# EasyEDA Pro project cyber_sandglass2.eprj

# Schematic arduino_nano_2
Board Name: arduino_nano_2; Create Date: 2025-11-16; Page Name: P1; Project Name: arduino_nano_2; Schematic Name: arduino_nano_2; Update Date: 2025-11-16; Company: 嘉立创EDA; Page Size: A4; Version: V1.0
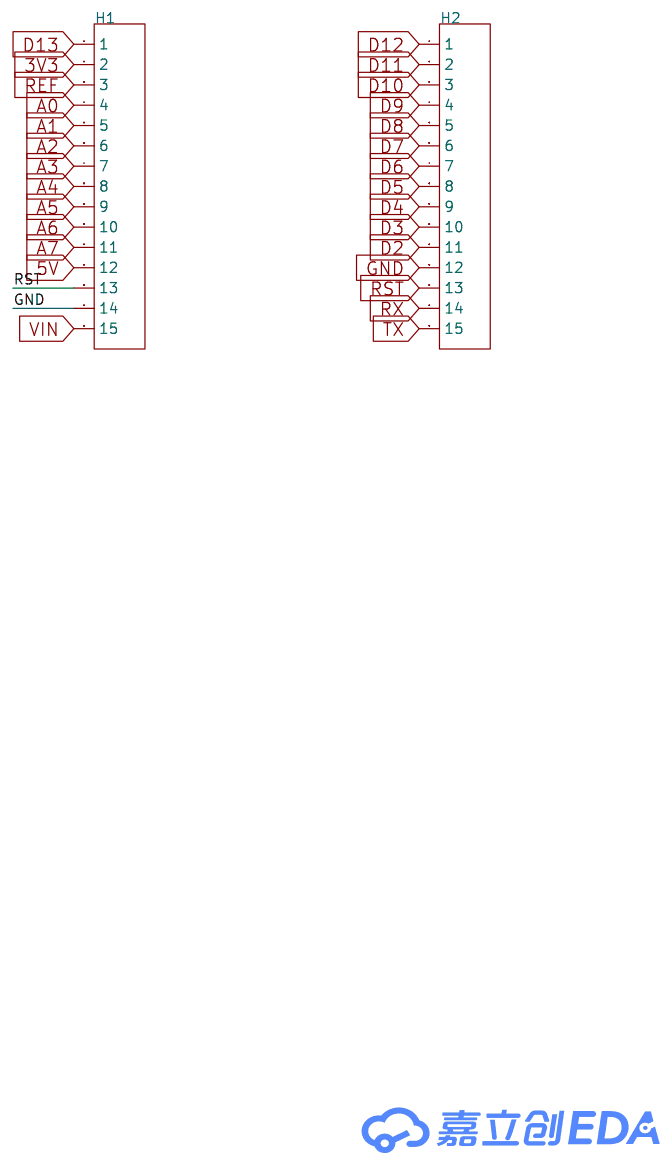
[diagram p0: schematic sheet]

## Parts
H1  -  [HDR-TH_15P-P2.54-V-F-1]
H2  -  [HDR-TH_15P-P2.54-V-F-1]

## Library data of the parts
H1 H2 = HDR-F_2.54_1x15P: Supplier Part: C124408; Supplier Footprint: 插件,

## Nets
3V3: H1.2
5V: H1.12
GND: H1.14 H2.12
VIN: H1.15
A0: H1.4
A1: H1.5
A2: H1.6
A3: H1.7
A4: H1.8
A5: H1.9
A6: H1.10
A7: H1.11
D2: H2.11
D3: H2.10
D4: H2.9
D5: H2.8
D6: H2.7
D7: H2.6
D8: H2.5
D9: H2.4
D10: H2.3
D11: H2.2
D12: H2.1
D13: H1.1
REF: H1.3
RST: H1.13 H2.13
RX: H2.14
TX: H2.15

# Schematic max7219
Board Name: max7219; Create Date: 2025-11-16; Page Name: P1; Project Name: max7219; Schematic Name: max7219; Update Date: 2025-11-16; Company: 嘉立创EDA; Page Size: A4; Version: V1.0
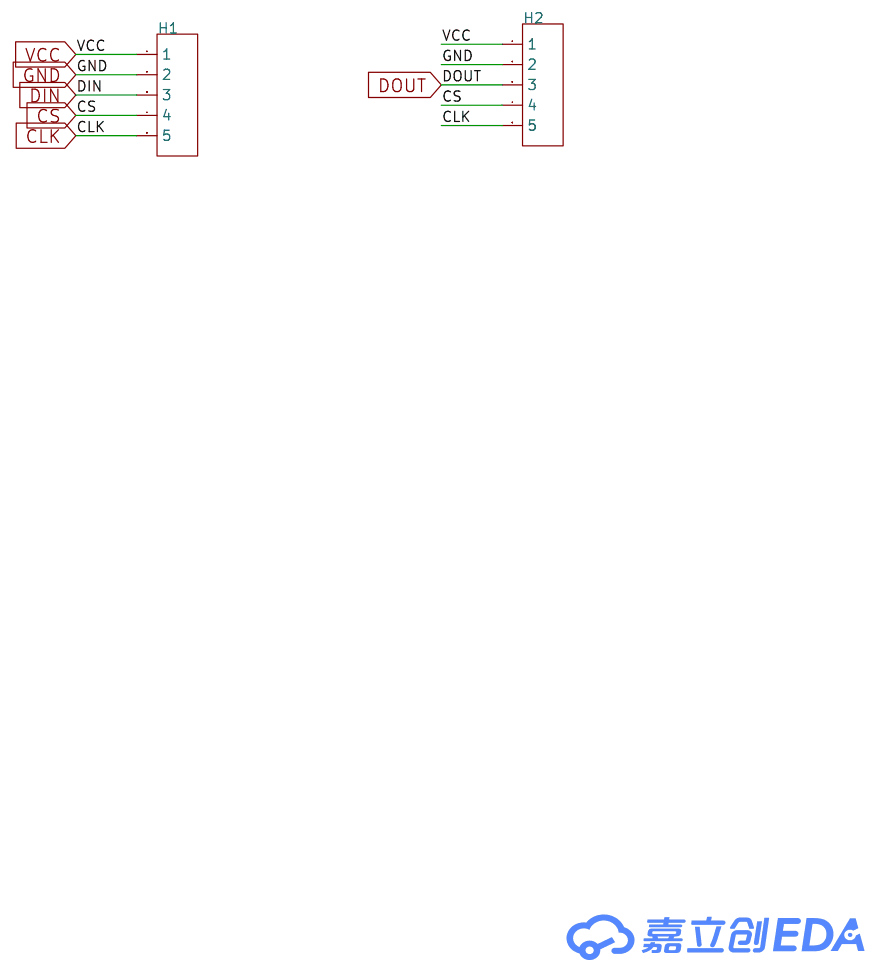
[diagram p1: schematic sheet]

## Parts
H1  -  [HDR-TH_5P-P2.54-V-F]
H2  -  [HDR-TH_5P-P2.54-V-F]

## Library data of the parts
H1 H2 = HDR-F_2.54_1x5P: Supplier Part: C50950; Supplier Footprint: 插件

## Nets
GND: H1.2 H2.2
VCC: H1.1 H2.1
CLK: H1.5 H2.5
CS: H1.4 H2.4
DIN: H1.3
DOUT: H2.3

# Schematic Schematic1
Board Name: Board1; Create Date: 2025-11-16; Page Name: P1; Project Name: 赛博沙漏2; Schematic Name: Schematic1; Update Date: 2025-11-16; Company: \; Page Size: A4; Version: V1.0
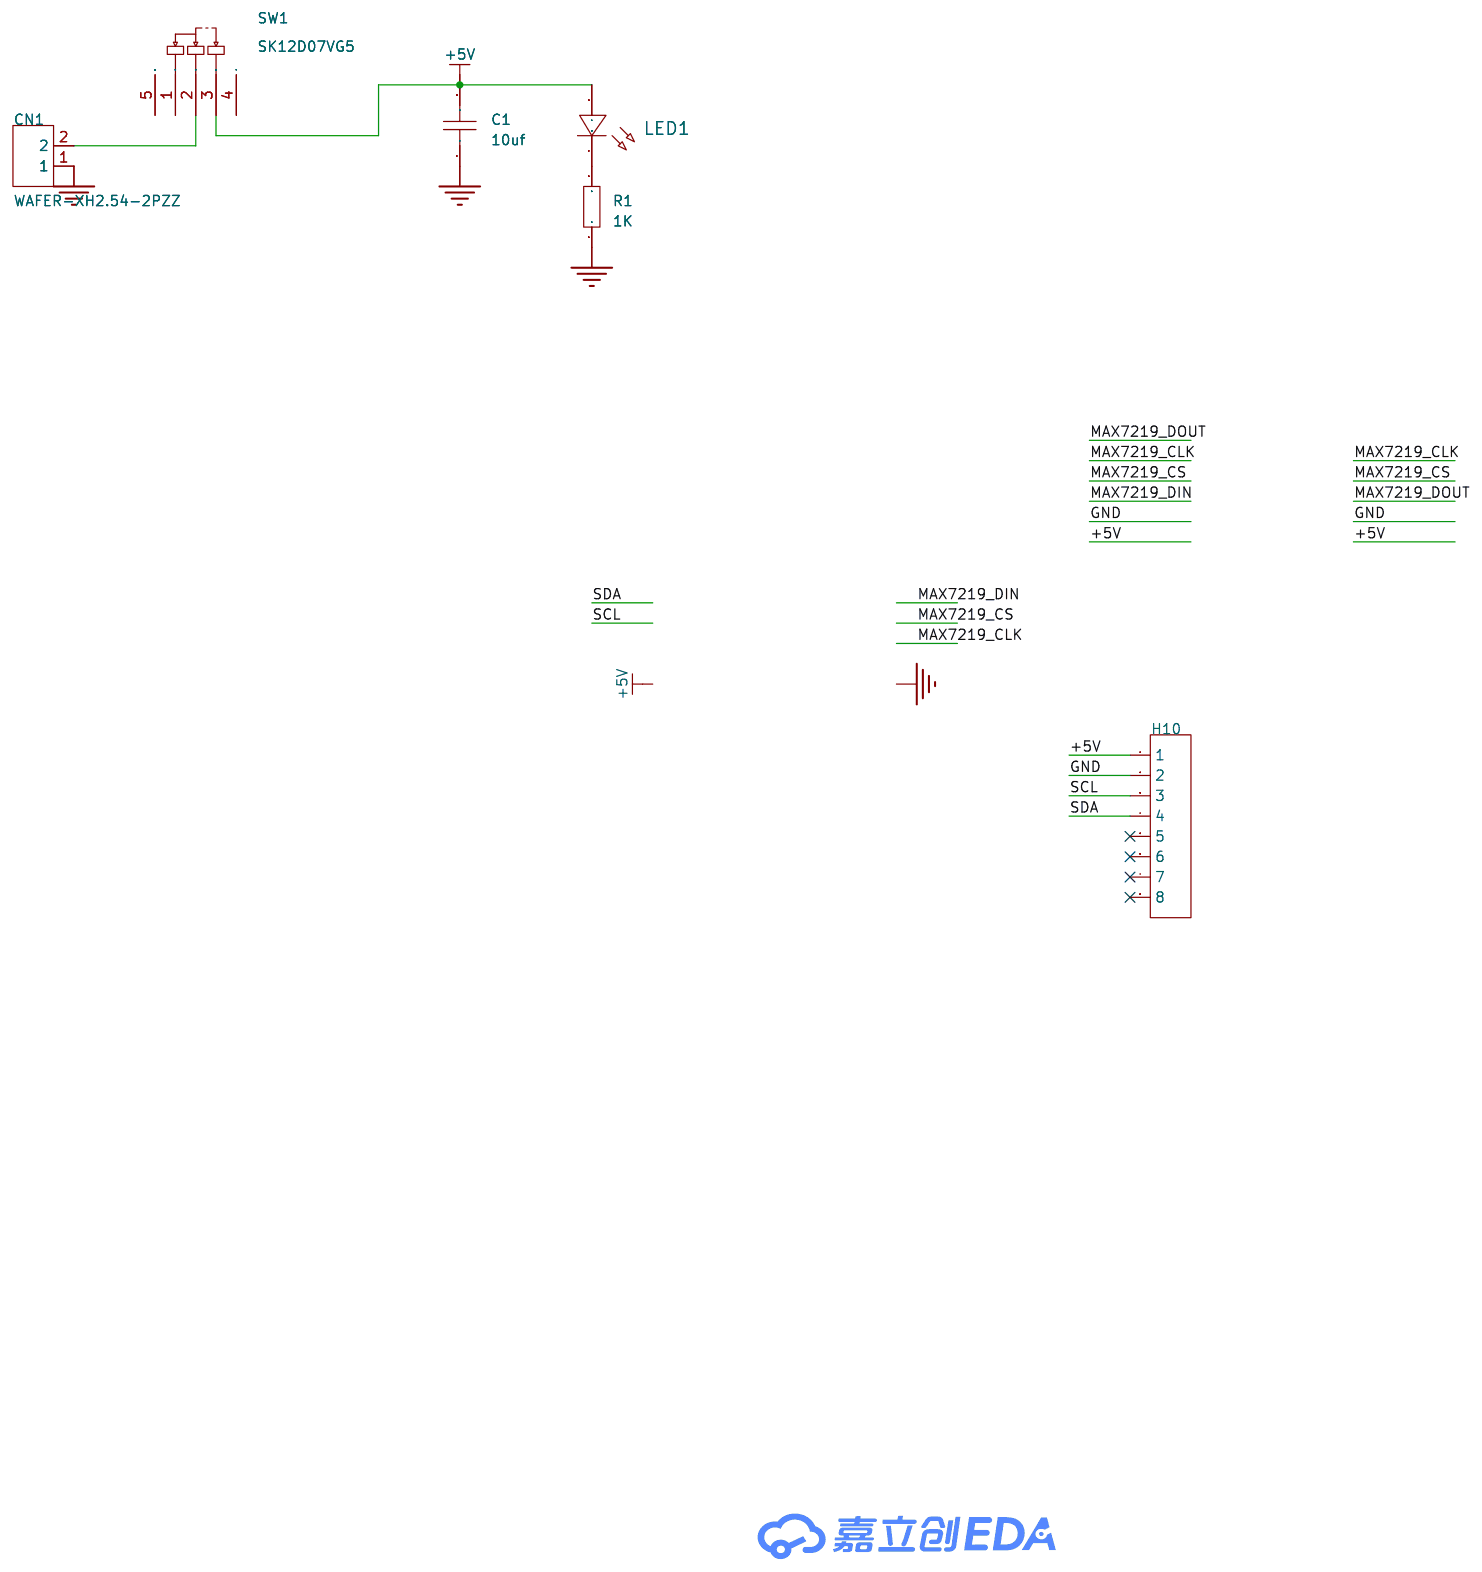
[diagram p2: schematic sheet]

## Parts
C1  10uf  [C0603]
CBB1  -
CBB2  -
CBB3  -
CN1  WAFER-XH2.54-2PZZ  [CONN-TH_WAFER-XH2.54-2PZZ]
H10  -  [HDR-TH_8P-P2.54-V-F-1]
LED1  -  [LED_0603]
R1  1K  [R0603]
SW1  SK12D07VG5  [SW-TH_SK12D07VG5-1]

## Library data of the parts
C1 = CAP_0603: Supplier Footprint: 0603
CN1 = WAFER-XH2.54-2PZZ: 插针结构:1x2P;间距:2.5mm;安装方式:直插;参考系列:XH;总PIN数:2P;排数:1;每排PIN数:2;行距:-;额定电流:2A;触头材质:黄铜;触头镀层:锡;工作温度:-25℃~+85℃;; LCSC Part Name: 1x2P 间距:2.5mm 直插 系列:XH; Supplier Part: C5359631; Manufacturer: XUNPU(讯普); Supplier Footprint: 插件,P=2.5mm; JLCPCB Part Class: 扩展库; Datasheet: https://item.szlcsc.com/datasheet/WAFER-XH2.54-2PZZ/6173867.html; Supplier: LCSC; Pins Structure: 1x2P; Pitch: 2.5mm; Mounting Type: 直插; Reference Series: XH; Number of Pins: 2P; Number of Rows: 1; Number of PINs Per Row: 2; Current Rating: 2A; Contact Material: 黄铜; Contact Plating: 锡; Operating Temperature: -25℃~+85℃; Voltage Rating: 250V; Plastic Material: PA66; Flame Retardant Rating: UL94V-0; Color: 白色; Z-Height of the Board: 7mm; X-Length of Bottom Edge on Board (Spacing Line): 7.5mm; Y-Width of Bottom Edge on Board: 5.9mm
H10 = HDR-F_2.54_1x8P: Supplier Part: C27438; Supplier Footprint: 插件
LED1 = LED_0603-R: Supplier Footprint: 0603
R1 = Res_0603: Supplier Footprint: 0603
SW1 = SK12D07VG5: 电路结构:单刀双掷;安装方式:-;开关颜色:-;额定电流:500mA;额定电压:50V;工作寿命:5千次;; LCSC Part Name: 两档位卧式拨动开关,柄长5MM; Supplier Part: C431548; Manufacturer: SHOU HAN(首韩); Supplier Footprint: 插件,8.7x4.4mm; JLCPCB Part Class: 扩展库; Datasheet: https://item.szlcsc.com/datasheet/SK12D07VG5/427905.html; Supplier: LCSC; Circuit: 单刀双掷; Termination Style: PC引脚; Length: 8.7mm; Width: 4.4mm; Switch Height: 4.7mm; Current Rating: 500mA; Voltage Rating: 50V; Life: 5千次; Operating Temperature: -10℃~+50℃

## Nets
+5V: C1.1 C1.2 CBB1.(VCC) CBB2.(VCC) CBB3.(VIN) CN1.1 H10.1 H10.2 H10.3 H10.4 LED1.2(A) R1.1 SW1.3
$1N2934: LED1.1(C) R1.2
$1N3536: CN1.2 SW1.2

Not connected (* = marked no-connect by the designer): H10 5* 6* 7* 8*; SW1 1 4 5

# Board max7219
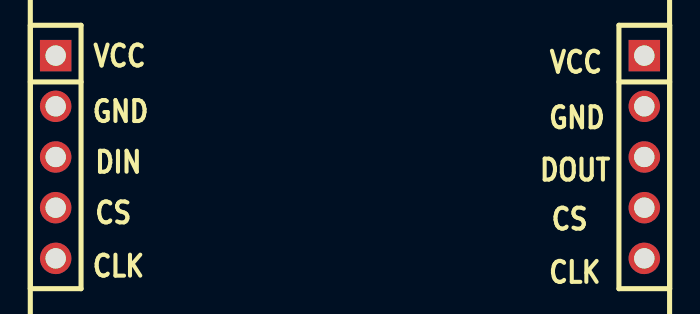
[diagram p3: board, top side]
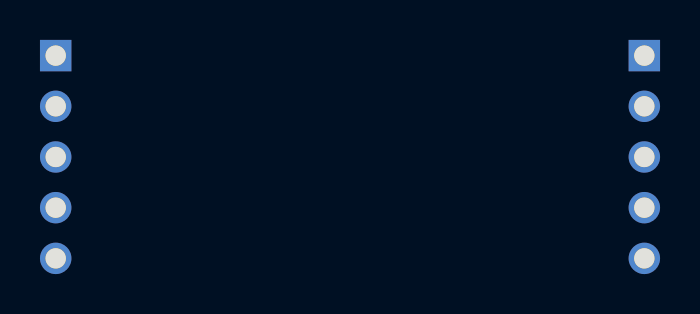
[diagram p4: board, bottom side, seen from below]

No outline. copper layers: Top Layer, Bottom Layer. Coordinates in mm from the lowest, leftmost part position.
Stack: Top Layer 0.035mm / Dielectric1 1.51mm FR4 er 4.5 / Bottom Layer 0.035mm

## Design rules (mm)
template: JLCPCB Capability(Two Layers Board)
spacing copperThickness1oz (default): track to track 0.102, other pairs 0.152 to 0.3
spacing copperThickness2oz: track to track 0.203, other pairs 0.152 to 0.3
track width copperThickness1oz (default): min 0.127, default 0.254, max 2.54
track width copperThickness2oz: min 0.203, default 0.254, max 2.54
differential pair differentialPair (default): width min 0.127, default 0.254, max 2.54; gap min 0.152, default 0.152
via viaSize (default): diameter min 0.5, default 0.61, max 10; hole min 0.3, default 0.305, max 6.3

## Placement (name value [footprint] x y rotation side)
H1  -  [HDR-TH_5P-P2.54-V-F]  0 0 270 top
H2  -  [HDR-TH_5P-P2.54-V-F]  29.46 0 270 top

## Footprints (pads in the part's own frame, mm; a bottom-side part is the same pattern mirrored in y, then rotated)
HDR-TH_5P-P2.54-V-F
  rect 1.575x1.575 hole 1.02: 1(-5.08,0)
  round 1.575 hole 1.02: 2(-2.54,0) 3(0,0) 4(2.54,0) 5(5.08,0)

## Nets
As in the schematic.

## Text on the board
Top Silkscreen Layer: GND | CLK | VCC | DIN | CS | DOUT | MAX7219

# Board arduino_nano_2
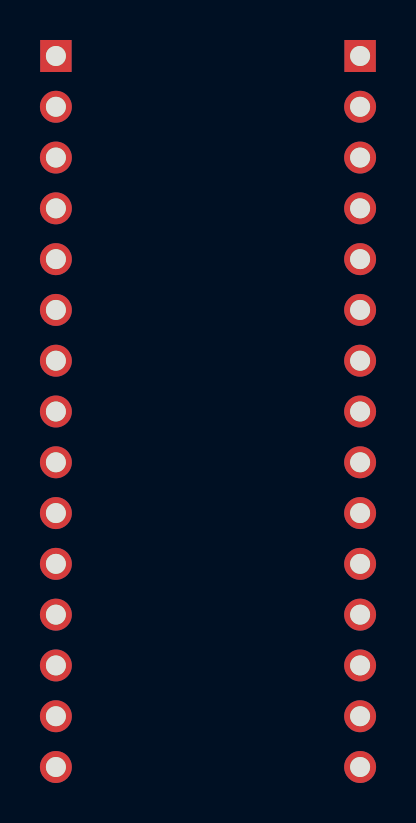
[diagram p5: board, top side]
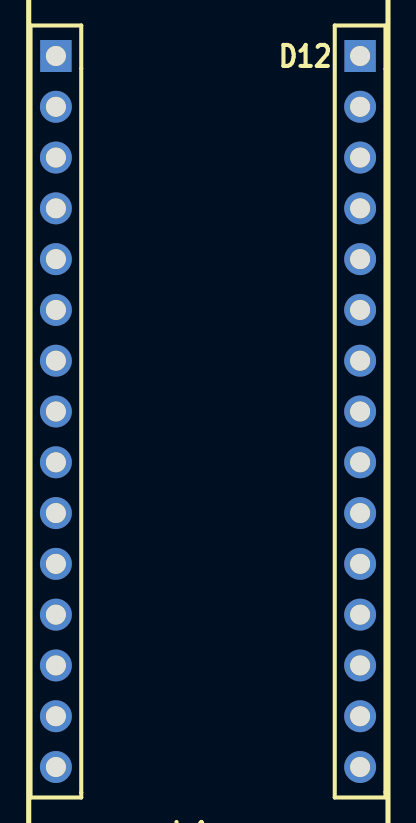
[diagram p6: board, bottom side, seen from below]

No outline. copper layers: Top Layer, Bottom Layer. Coordinates in mm from the lowest, leftmost part position.
Stack: Top Layer 0.035mm / Dielectric1 1.51mm FR4 er 4.5 / Bottom Layer 0.035mm

## Design rules (mm)
template: JLCPCB Capability(Two Layers Board)
spacing copperThickness1oz (default): track to track 0.102, other pairs 0.152 to 0.3
spacing copperThickness2oz: track to track 0.203, other pairs 0.152 to 0.3
track width copperThickness1oz (default): min 0.127, default 0.254, max 2.54
track width copperThickness2oz: min 0.203, default 0.254, max 2.54
differential pair differentialPair (default): width min 0.127, default 0.254, max 2.54; gap min 0.152, default 0.152
via viaSize (default): diameter min 0.5, default 0.61, max 10; hole min 0.3, default 0.305, max 6.3

## Placement (name value [footprint] x y rotation side)
H1  -  [HDR-TH_15P-P2.54-V-F-1]  15.24 0 270 bottom
H2  -  [HDR-TH_15P-P2.54-V-F-1]  0 0 270 bottom

## Footprints (pads in the part's own frame, mm; a bottom-side part is the same pattern mirrored in y, then rotated)
HDR-TH_15P-P2.54-V-F-1
  rect 1.6x1.575 hole 1: 1(-17.78,0)
  round 1.6 hole 1: 2(-15.24,0) 3(-12.7,0) 4(-10.16,0) 5(-7.62,0) 6(-5.08,0) 7(-2.54,0) 8(0,0) 9(2.54,0) 10(5.08,0) 11(7.62,0) 12(10.16,0) 13(12.7,0) 14(15.24,0) 15(17.78,0)

## Nets
As in the schematic.

## Text on the board
Bottom Silkscreen Layer: D12 | arduino nano

# Board PCB1
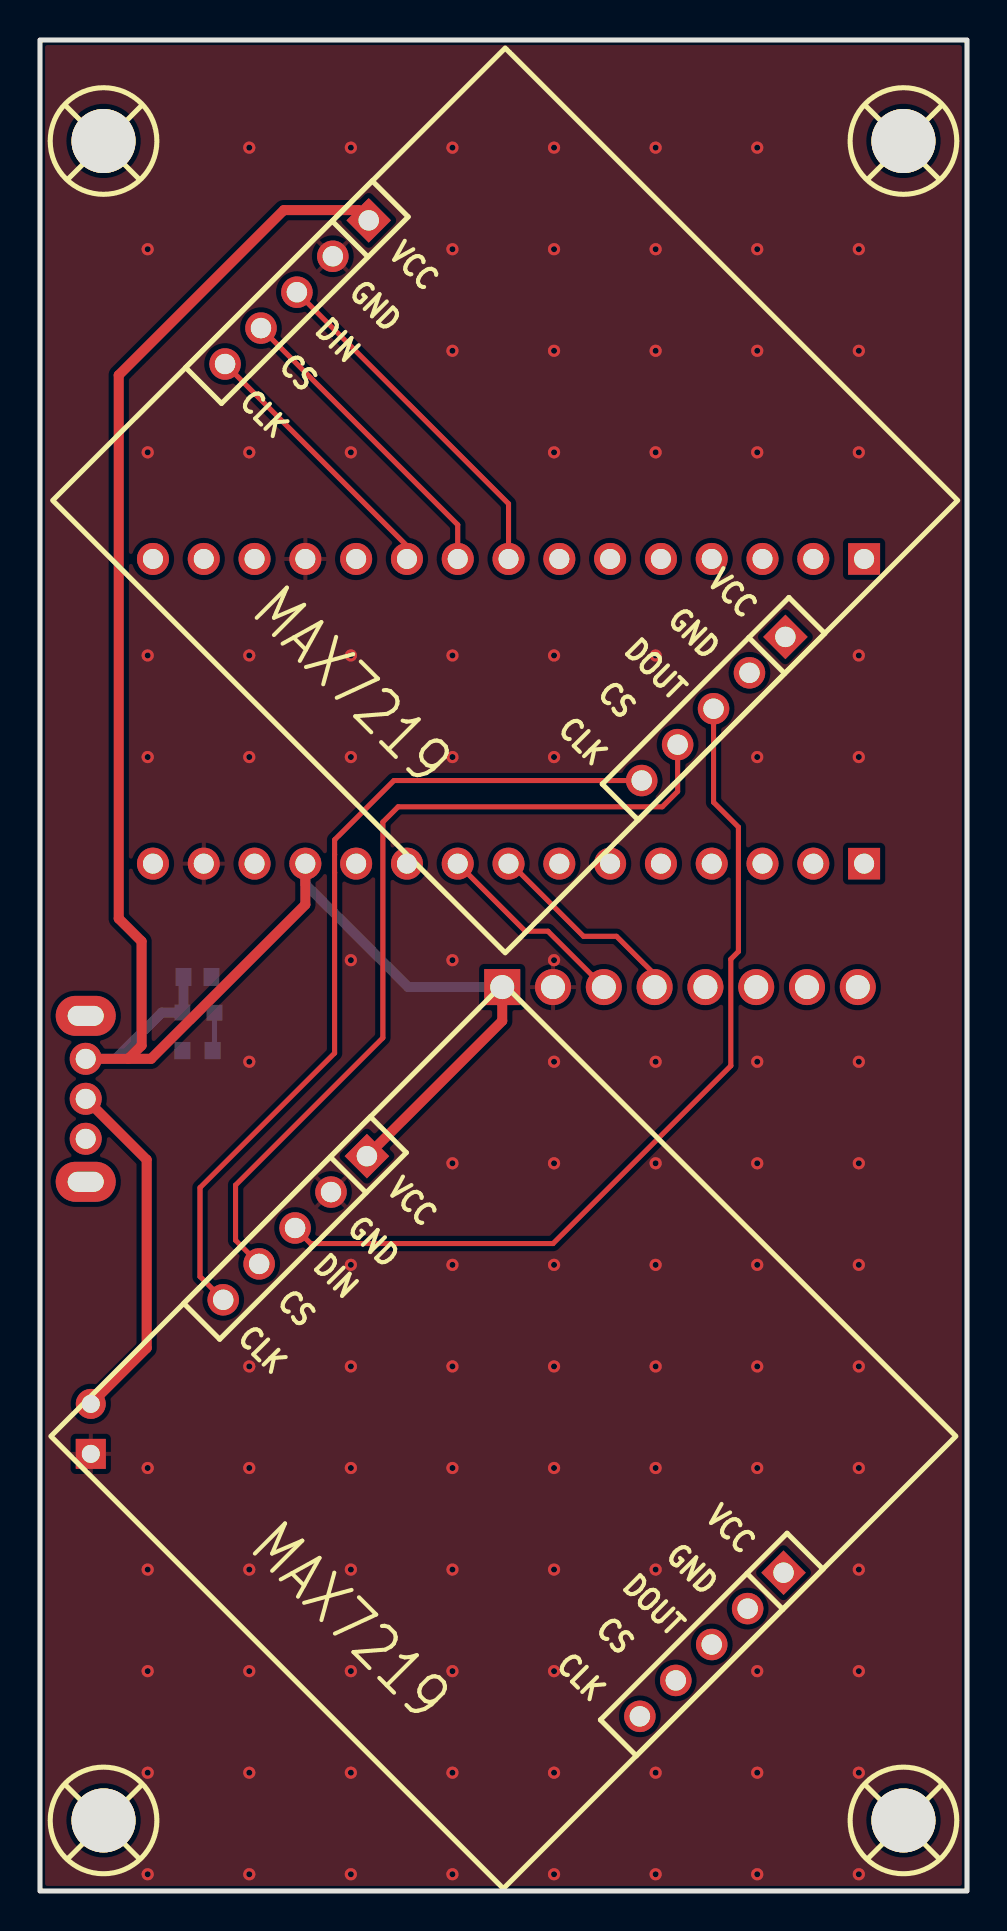
[diagram p7: board, top side]
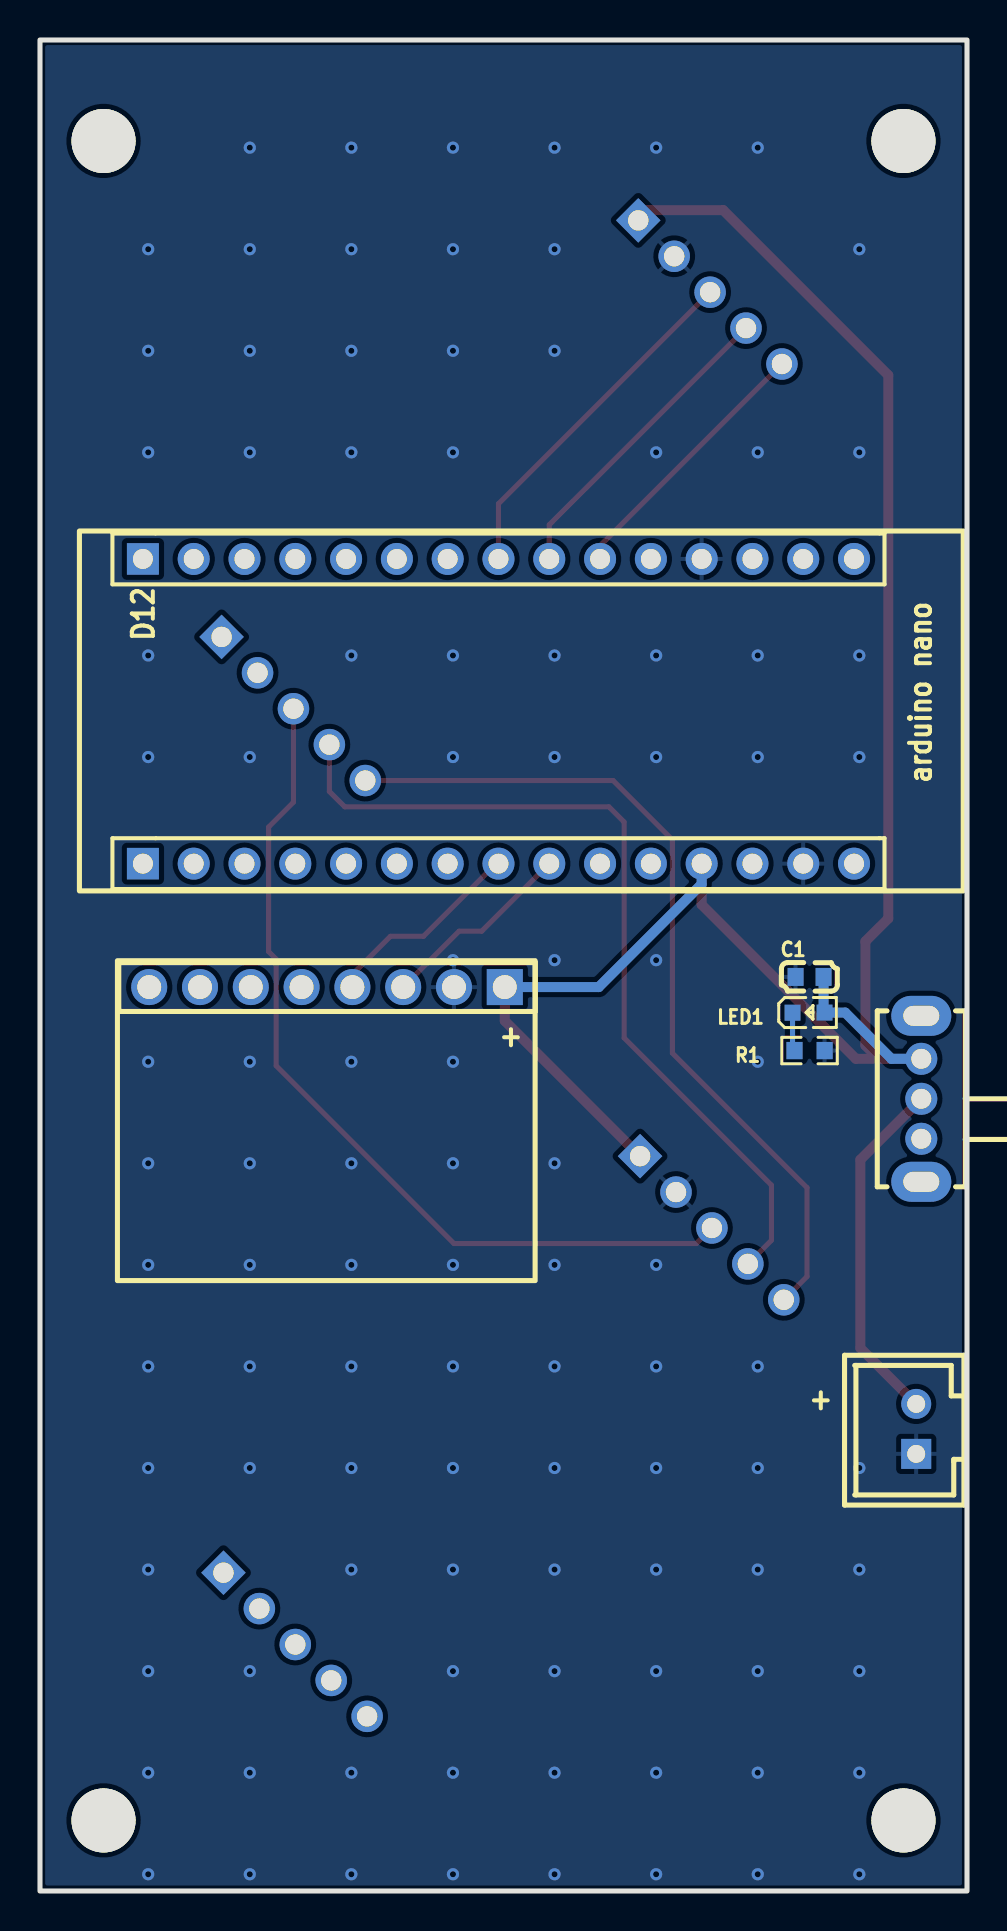
[diagram p8: board, bottom side, seen from below]

Outline 46.36 x 92.58 mm; copper layers: Top Layer, Bottom Layer. Coordinates in mm from the lower left corner of the outline.
Outline path: rectangle 0,92.58 46.36,0
Stack: Top Layer 0.035mm / Dielectric1 1.51mm FR4 er 4.5 / Bottom Layer 0.035mm

## Design rules (mm)
template: JLCPCB Capability(Two Layers Board)
spacing copperThickness1oz (default): track to track 0.102, other pairs 0.152 to 0.3
spacing copperThickness2oz: track to track 0.203, other pairs 0.152 to 0.3
track width copperThickness1oz (default): min 0.127, default 0.254, max 2.54
track width copperThickness2oz: min 0.203, default 0.254, max 2.54
differential pair differentialPair (default): width min 0.127, default 0.254, max 2.54; gap min 0.152, default 0.152
via viaSize (default): diameter min 0.5, default 0.61, max 10; hole min 0.3, default 0.305, max 6.3

## Placement (name value [footprint] x y rotation side)
C1  10uf  [C0603]  7.87 45.72 180 bottom
CN1  WAFER-XH2.54-2PZZ  [CONN-TH_WAFER-XH2.54-2PZZ]  2.54 23.11 90 bottom
H1  -  [HDR-TH_15P-P2.54-V-F-1]  23.43 51.39 180 bottom
H2  -  [HDR-TH_15P-P2.54-V-F-1]  23.43 66.63 180 bottom
H3  -  [HDR-TH_5P-P2.54-V-F]  12.85 79.97 225 top
H4  -  [HDR-TH_5P-P2.54-V-F]  33.68 59.13 225 top
H8  -  [HDR-TH_5P-P2.54-V-F]  12.76 33.16 225 top
H9  -  [HDR-TH_5P-P2.54-V-F]  33.59 12.33 225 top
H10  -  [HDR-TH_8P-P2.54-V-F-1]  32 45.21 0 bottom
LED1  -  [LED_0603]  7.87 43.94 180 bottom
R1  1K  [R0603]  7.87 42.04 0 bottom
SCREW1  -  [M3螺丝]  43.24 87.47 0 top
SCREW2  -  [M3螺丝]  43.24 3.47 0 top
SCREW3  -  [M3螺丝]  3.24 87.47 0 top
SCREW4  -  [M3螺丝]  3.24 3.47 0 top
SW1  SK12D07VG5  [SW-TH_SK12D07VG5-1]  2.29 39.62 90 bottom

## Footprints (pads in the part's own frame, mm; a bottom-side part is the same pattern mirrored in y, then rotated)
C0603
  rect 0.8x0.9 smd: 1(-0.7,0) 2(0.7,0)
CONN-TH_WAFER-XH2.54-2PZZ
  rect 1.5x1.5 hole 0.9: 1(-1.25,0)
  round 1.5 hole 0.9: 2(1.25,0)
HDR-TH_5P-P2.54-V-F
  rect 1.575x1.575 hole 1.02: 1(-5.08,0)
  round 1.575 hole 1.02: 2(-2.54,0) 3(0,0) 4(2.54,0) 5(5.08,0)
HDR-TH_8P-P2.54-V-F-1
  rect 1.8x1.8 hole 1.2: 1(-8.89,0)
  round 1.8 hole 1.2: 2(-6.35,0) 3(-3.81,0) 4(-1.27,0) 5(1.27,0) 6(3.81,0) 7(6.35,0) 8(8.89,0)
HDR-TH_15P-P2.54-V-F-1
  rect 1.6x1.575 hole 1: 1(-17.78,0)
  round 1.6 hole 1: 2(-15.24,0) 3(-12.7,0) 4(-10.16,0) 5(-7.62,0) 6(-5.08,0) 7(-2.54,0) 8(0,0) 9(2.54,0) 10(5.08,0) 11(7.62,0) 12(10.16,0) 13(12.7,0) 14(15.24,0) 15(17.78,0)
LED_0603
  rect 0.8x0.8 smd: 1(-0.851,-0.01) 2(0.75,-0.005)
M3螺丝
  round 3.2 hole 3.2: 1(-0.064,0.064)
R0603
  rect 0.806x0.864 smd: 1(-0.753,0) 2(0.753,0)
SW-TH_SK12D07VG5-1
  oval 1.6x1.6 hole 1: 1(-2,0) 2(0,0) 3(2,0)
  oval 2x3 hole 1x1.8: 4(4.15,0) 5(-4.15,0)

## Nets
+5V: C1.2 H1.12 H3.1 H8.1 H10.1 LED1.2 SW1.3
GND: C1.1 CN1.1 H1.14 H2.12 H3.2 H8.2 H10.2 R1.1
$1I2618\3V3: H1.2
$1I2618\A0: H1.4
$1I2618\A1: H1.5
$1I2618\A2: H1.6
$1I2618\A3: H1.7
$1I2618\A6: H1.10
$1I2618\A7: H1.11
$1I2618\D2: H2.11
$1I2618\D6: H2.7
$1I2618\D7: H2.6
$1I2618\D8: H2.5
$1I2618\D9: H2.4
$1I2618\D10: H2.3
$1I2618\D11: H2.2
$1I2618\D12: H2.1
$1I2618\D13: H1.1
$1I2618\REF: H1.3
$1I2618\RX: H2.14
$1I2618\TX: H2.15
$1I2618\VIN: H1.15
CLK2: H4.5 H8.5
CS2: H4.4 H8.4
MAX7219_CLK: H2.10 H3.5
MAX7219_CS: H2.9 H3.4
MAX7219_DIN: H2.8 H3.3
MAX7219_DOUT: H4.3 H8.3
SCL: H1.9 H10.3
SDA: H1.8 H10.4
$1N2934: LED1.1 R1.2
$1N3536: CN1.2 SW1.2

Pads without a net: H1 13; H2 13; H4 1 2; H9 1 2 3 4 5; H10 5 6 7 8; SCREW1 1; SCREW2 1; SCREW3 1; SCREW4 1; SW1 1 4 5

## Via types
v1: diameter 0.61, hole 0.305, Top Layer to Bottom Layer, 102 vias

## Routing (per net, layer and track width the routed paths; a pad name or vN(x,y) marks a point on that pad's centre or on a via; arc(x,y) is an arc through that point)
+5V: length 99.2
  Top Layer w0.5: 4.41,41.62 5.56,41.62 13.27,49.34 H1.12 ; 4.41,41.62 SW1.3 ; 4.41,41.62 5.08,42.29 5.08,47.5 3.94,48.64 3.94,75.82 12.19,84.07 15.93,84.07 16.44,83.56 ; 16.35,36.76 23.11,43.52 H10.1
  Bottom Layer w0.5: H1.12 13.27,50.36 18.42,45.21 H10.1 ; 7.17,45.72 7.17,43.99 LED1.2 6.09,43.94 3.78,41.62 SW1.3
GND:
  vias: v1(5.39,82.12) v1(5.39,71.96) v1(5.39,61.8) v1(5.39,56.72) v1(5.39,21.16) v1(5.39,16.08) v1(5.39,11) v1(5.39,5.92) v1(5.39,0.84) v1(10.46,87.2) v1(10.46,71.96) v1(10.46,61.8) v1(10.46,56.72) v1(10.46,41.48) v1(10.46,26.24) v1(10.46,21.16) v1(10.46,16.08) v1(10.46,11) v1(10.46,5.92) v1(10.46,0.84) v1(15.55,87.2) v1(15.55,71.96) v1(15.55,61.8) v1(15.55,56.72) v1(15.55,46.56) v1(15.55,31.32) v1(15.55,26.24) v1(15.55,21.16) v1(15.55,16.08) v1(15.55,11) v1(15.55,5.92) v1(15.55,0.84) v1(20.62,87.2) v1(20.62,82.12) v1(20.62,77.04) v1(20.62,61.8) v1(20.62,56.72) v1(20.62,46.56) v1(20.62,36.4) v1(20.62,31.32) v1(20.62,26.24) v1(20.62,21.16) v1(20.62,16.08) v1(20.62,11) v1(20.62,5.92) v1(20.62,0.84) v1(25.7,87.2) v1(25.7,82.12) v1(25.7,77.04) v1(25.7,71.96) v1(25.7,61.8) v1(25.7,56.72) v1(25.7,46.56) v1(25.7,41.48) v1(25.7,36.4) v1(25.7,31.32) v1(25.7,26.24) v1(25.7,21.16) v1(25.7,16.08) v1(25.7,11) v1(25.7,5.92) v1(25.7,0.84) v1(30.79,87.2) v1(30.79,82.12) v1(30.79,77.04) v1(30.79,71.96) v1(30.79,61.8) v1(30.79,41.48) v1(30.79,36.4) v1(30.79,31.32) v1(30.79,26.24) v1(30.79,21.16) v1(30.79,16.08) v1(30.79,5.92) v1(30.79,0.84) v1(35.86,87.2) v1(35.86,82.12) v1(35.86,77.04) v1(35.86,71.96) v1(35.86,56.72) v1(35.86,41.48) v1(35.86,36.4) v1(35.86,31.32) v1(35.86,26.24) v1(35.86,21.16) v1(35.86,11) v1(35.86,5.92) v1(35.86,0.84) v1(40.95,82.12) v1(40.95,77.04) v1(40.95,71.96) v1(40.95,61.8) v1(40.95,56.72) v1(40.95,41.48) v1(40.95,36.4) v1(40.95,31.32) v1(40.95,26.24) v1(40.95,21.16) v1(40.95,16.08) v1(40.95,11) v1(40.95,5.92) v1(40.95,0.84)
CLK2: length 42.9
  Top Layer w0.254: H4.5 17.7,55.54 14.73,52.58 14.73,51.83 14.73,51.83 14.73,50.94 14.73,50.94 14.73,41.91 8,35.18 8,30.73 H8.5
CS2: length 43.4
  Top Layer w0.254: H4.4 31.89,55 31.11,54.23 17.91,54.23 17.14,53.47 17.14,42.67 9.78,35.31 9.78,32.55 H8.4
MAX7219_CLK: length 13.5
  Top Layer w0.254: H2.10 18.35,67.28 H3.5
MAX7219_CS: length 15.6
  Top Layer w0.254: H3.4 20.89,68.33 H2.9
MAX7219_DIN: length 17.7
  Top Layer w0.254: H3.3 23.43,69.39 H2.8
MAX7219_DOUT: length 44.3
  Top Layer w0.254: H8.3 13.53,32.39 25.65,32.39 34.54,41.28 34.54,46.61 34.92,46.99 34.92,53.21 33.68,54.46 H4.3
SCL: length 9.9
  Top Layer w0.254: H1.9 24.27,48.01 25.4,48.01 H10.3
SDA: length 10.2
  Top Layer w0.254: H10.4 30.73,45.85 28.83,47.75 27.18,47.75 23.54,51.39 H1.8
$1N2934: length 1.9
  Bottom Layer w0.254: R1.2 8.73,42.13 LED1.1
$1N3536: length 17.7
  Top Layer w0.5: CN1.2 5.33,27.16 5.33,36.58 SW1.2

## Copper pours and planes (outline as drawn; the poured copper is in the pictures)
GND on Top Layer: 0.25,92.71 46.36,92.71 46.36,0 0.25,0
GND on Bottom Layer: 0,92.71 46.36,92.71 46.36,0.27 0,0.27

## Text on the board
Bottom Silkscreen Layer: + | arduino nano | D12
Top Silkscreen Layer: CLK | CS | DIN | GND | VCC | DOUT | MAX7219
